# Altium schematic sheet 04_CAN.SchDoc: =TitleParameter
size A3; Organization: ASISGUARD; Address1: Kemalpasa, Kemalpasa Cd. No:290 D:292H, 35060 Bornova/Izmir/Turkey; SheetNumber: 4; SheetTotal: 6
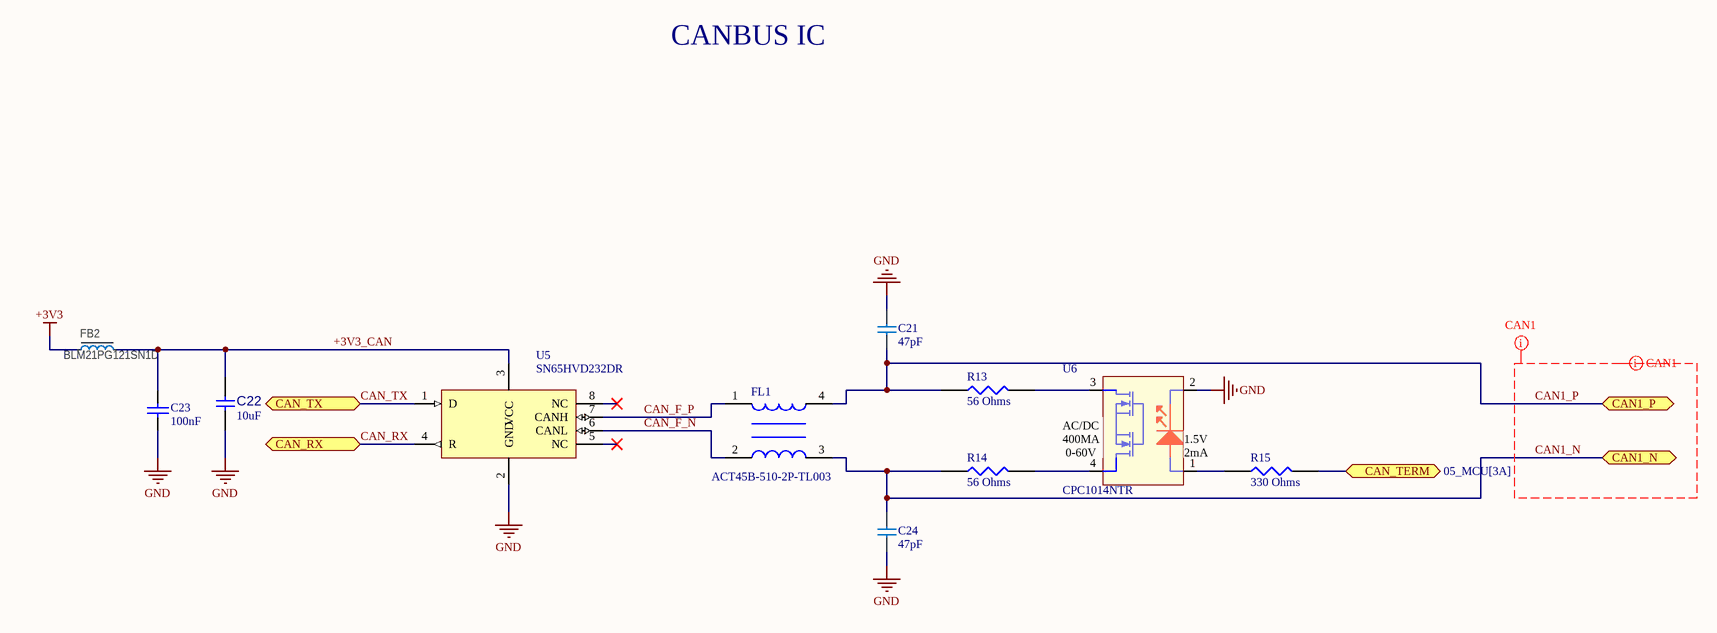
[diagram p0: 04_CAN.SchDoc]

## Parts
C21  47pF  [CAPC1608X100N]
C22  10uF  [0603_C]
C23  100nF  [CAP0603]
C24  47pF  [CAPC1608X100N]
FB2  BLM21PG121SN1D  [INDC2012X11L]
FL1  ACT45B-510-2P-TL003  [FIL_ACT45B-510-2P-TL003]
R13  56 Ohms  [RES_0402]
R14  56 Ohms  [RES_0402]
R15  330 Ohms  [RES_0402]
U5  SN65HVD232DR  [SOIC8]
U6  CPC1014NTR  [4-SOP]

## Ports
CAN1_N (bidir, see 03_POWER[1A]), CAN1_P (bidir, see 03_POWER[1A]), CAN_RX (bidir, see 05_MCU[3A]), CAN_TERM (bidir, see 05_MCU[3A]), CAN_TX (bidir, see 05_MCU[3A])

## Nets
+3V3: FB2.1
GND: C21.2 C22.1 C23.2 C24.1 U5.2(GND) U6.2(CATHODE1)
+3V3_CAN: C22.2 C23.1 FB2.2 U5.3(VCC)
CAN1_N: C24.2 FL1.3 R14.1 ; port CAN1_N
CAN1_P: C21.1 FL1.4 R13.1 ; port CAN1_P
CAN_F_N: FL1.2 U5.6(CANL)
CAN_F_P: FL1.1 U5.7(CANH)
CAN_RX: U5.4(R) ; port CAN_RX
CAN_TERM: R15.2 ; port CAN_TERM
CAN_TX: U5.1(D) ; port CAN_TX
NetR13_2: R13.2 U6.3
NetR14_2: R14.2 U6.4
NetR15_1: R15.1 U6.1(ANODE)

Not connected (* = marked no-connect by the designer): U5 5(NC)* 8(NC)*

## Layout directives
net class CAN1: CAN1_N, CAN1_P
differential pair; differential pair class ZDIFF120; net class CAN_BUS: CAN1_N, CAN1_P

## Notes on the sheet
- CANBUS IC
- Proje/Project:
- Sayfa Adı/Document Name:
- Çizilme Tarihi/Drawing Date
- Umit KAYACIK
- Tasarlayan/Designed By
- Sayfa/Sheet:
- Revision:
- of
- Son Güncelleme/Last Edit Date
- Kontrol eden/Checked By
- Onaylayan/Approved By
- Boyut/Size:
- Varyant/Variant:
- Dil/Language:
- A3
- ENG
- (in symbol CPC1014NTR) AC/DC / 400MA / 0-60V; 1.5V / 2mA /

## Library data of the parts
C21 C24 = GMC10CG470F200NT: 47 pF ±1% 200V Ceramic Capacitor C0G, NP0 0603 (1608 Metric); Manufacturer: Cal-Chip Electronics, Inc.; MPN: GMC10CG470F200NT; Supplier: 4713-GMC10CG470F200NTDKR-ND
C22 = CAP1461: CAP CER 10UF 25V X5R 0603; Manufacturer: Murata Electronics North America; Manufacturer Part Number: GRM188R61E106MA73D; Value: 10uF; Voltage: 25V; Revision: 1; Supplier Part Number: 490-7202-1-ND
C23 = CAP0603_100nF: CAP CER 0.1UF 50V X7R 0603; P/N: C0603C104K5RACTU; Value: 100nF 50V; Order Code: DIGI : 399-5089-1-ND
FB2 = FB0402-120R@100M-500mA: Ferrite Bead, 120 Ohm @ 100MHz, 500mA, 250 mOhm Max; Manufacturer: Murata; Manufacturer Part Number: BLM15AG121SN1D; Part number IPS: 00000009954; Part number Norautron: 265230631; Part number NEMS: 100300099; Value: 120R/0.55A; Note: Chip EMIFIL Inductor Type Chip Ferrite Bead; Artikkelnr Noca: 33029317; Pad Count: 2; Component Status: Active; Part Number: FB0402-120R@100M-500mA; Footprint Doc: 0402; LatestRevisionDate: 2014-01-10; Published: 2011-11-14; ComponentLink1Description: Datasheet; ComponentLink2Description: Supplier link; ComponentLink1URL: N.A.; ComponentLink2URL: N.A.; HelpURL: http://search.murata.co.jp/Ceramy/image/img/PDF/ENG/L0110S0100BLM15A_SN.pdf; Supplier 1: Digi-Key; Supplier Part Number 1: 490-1005-1-ND; Supplier 2: Farnell; Supplier Part Number 2: 151-5760; Component Class: Inductors; PartId: 100300099; Author: rsk
FL1 = ACT45B-510-2P-TL003: 51 ÂµH @ 100 kHz 2 Line Common Mode Choke Surface Mount 2.8 kOhms @ 10 MHz 200mA DCR 1Ohm; MF: TDK; SnapEDA_Link: https://www.snapeda.com/parts/ACT45B-510-2P-TL003/TDK/view-part/?ref=snap; Package: Horizontal-4 TDK; Value: *; MP: ACT45B-510-2P-TL003; Check_prices: https://www.snapeda.com/parts/ACT45B-510-2P-TL003/TDK/view-part/?ref=eda
R13 R14 = RMCF0402FT56R0: 56 Ohms ±1% 0.063W, 1/16W Chip Resistor 0402 (1005 Metric) Automotive AEC-Q200 Thick Film; Manİfacturer: Stackpole Electronics Inc; Supplier: Digi; RMCF0402FT56R0DKR-ND
R15 = RMCF0402FT330R: 330 Ohms ±1% 0.063W, 1/16W Chip Resistor 0402 (1005 Metric) Automotive AEC-Q200 Thick Film; Manifacturer: Stackpole Electronics Inc; Supplier: Digi; RMCF0402FT330RDKR-ND
U5 = SN65HVD232DR: 1Mbps Transceiver 3V~3.6V SOIC-8 CAN ICs ROHS; Manufacturer Part Number: SN65HVD232DR; LCSC Part Number: C30530
U6 = CPC1014NTR: SSR RELAY SPST-NO 400MA 0-60V; Manufacturer: IXYS Integrated Circuits Division; Manufacturer Part Number: CPC1014NTR; Supplier Part Number: CLA314CT-ND